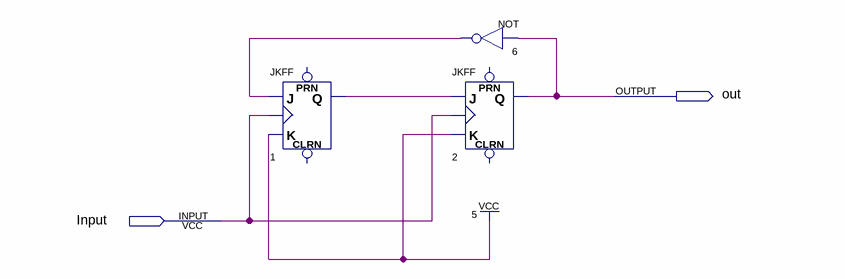
[diagram p0: schematic sheet]
// Quartus schematic divizor3.bdf as structural Verilog: 3 symbols, 2 pins
module divizor3 (
  input  Input,
  output out
);

  wire n1_q, n6_out;

  JKFF u_1 (.K(1'b1), .J(n6_out), .CLK(Input), .Q(n1_q));  // open: PRN, CLRN
  not u_6 (n6_out, out);
  JKFF u_2 (.K(1'b1), .J(n1_q), .CLK(Input), .Q(out));  // open: PRN, CLRN
endmodule
